# Altium schematic sheet Core.SchDoc
size A4; Author: vseasky; Address1: https://docs.liuwei.vin; Revision: V0.2; SheetNumber: 3; SheetTotal: 4
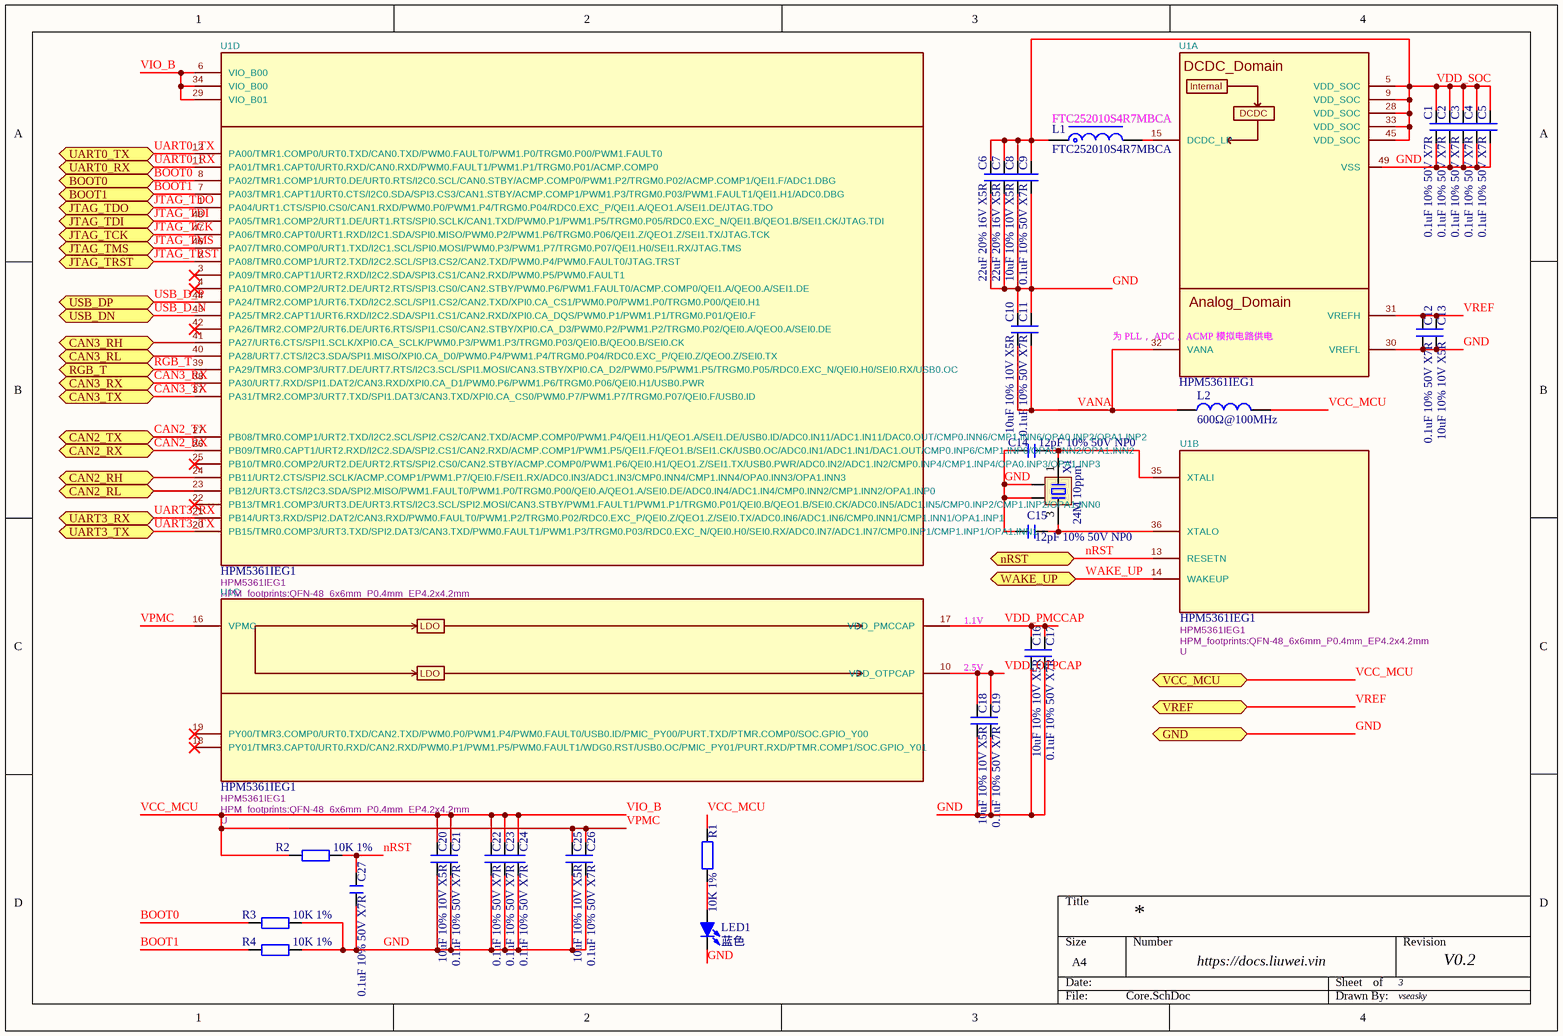
[diagram p0: Core.SchDoc]

## Parts
C1  0.1uF 10% 50V X7R  [C 0603_L]
C2  0.1uF 10% 50V X7R  [C 0603_L]
C3  0.1uF 10% 50V X7R  [C 0603_L]
C4  0.1uF 10% 50V X7R  [C 0603_L]
C5  0.1uF 10% 50V X7R  [C 0603_L]
C6  22uF 20% 16V X5R  [C 0603_L]
C7  22uF 20% 16V X5R  [C 0603_L]
C8  10uF 10% 10V X5R  [C 0603_L]
C9  0.1uF 10% 50V X7R  [C 0603_L]
C10  10uF 10% 10V X5R  [C 0603_L]
C11  0.1uF 10% 50V X7R  [C 0603_L]
C12  0.1uF 10% 50V X7R  [C 0603_L]
C13  10uF 10% 10V X5R  [C 0603_L]
C14  12pF 10% 50V NP0  [C 0603_L]
C15  12pF 10% 50V NP0  [C 0603_L]
C16  10uF 10% 10V X5R  [C 0603_L]
C17  0.1uF 10% 50V X7R  [C 0603_L]
C18  10uF 10% 10V X5R  [C 0603_L]
C19  0.1uF 10% 50V X7R  [C 0603_L]
C20  10uF 10% 10V X5R  [C 0603_L]
C21  0.1uF 10% 50V X7R  [C 0603_L]
C22  0.1uF 10% 50V X7R  [C 0603_L]
C23  0.1uF 10% 50V X7R  [C 0603_L]
C24  0.1uF 10% 50V X7R  [C 0603_L]
C25  10uF 10% 10V X5R  [C 0603_L]
C26  0.1uF 10% 50V X7R  [C 0603_L]
C27  0.1uF 10% 50V X7R  [C 0603_L]
L1  FTC252010S4R7MBCA  [NR2520]
L2  600Ω@100MHz  [L 0603_L]
LED1  蓝色  [LED 0603R]
R1  10K 1%  [R 0603_L]
R2  10K 1%  [R 0603_L]
R3  10K 1%  [R 0603_L]
R4  10K 1%  [R 0603_L]
U1  HPM5361IEG1  [QFN-48_6x6mm_P0.4mm_EP4.2x4.2mm]  (parts A,B,C,D of 4)
X1  24M 10ppm  [OSC 3225-4P]

## Ports
BOOT0 (bidir, see VCAN[5C]), BOOT1 (bidir, see VCAN[5C]), CAN2_RH (bidir, see VCAN[4D]), CAN2_RL (bidir, see VCAN[4D]), CAN2_RX (bidir, see VCAN[4E]), CAN2_TX (bidir, see VCAN[4E]), CAN3_RH (bidir, see VCAN[4C]), CAN3_RL (bidir, see VCAN[4C]), CAN3_RX (bidir, see VCAN[4D]), CAN3_TX (bidir, see VCAN[4D]), GND (bidir, see VCAN[4B]), JTAG_TCK (bidir, see VCAN[5E]), JTAG_TDI (bidir, see VCAN[5D]), JTAG_TDO (bidir, see VCAN[5D]), JTAG_TMS (bidir, see VCAN[5E]), JTAG_TRST (bidir, see VCAN[5D]), nRST (bidir, see VCAN[5D]), RGB_T (bidir, see VCAN[4C]), UART0_RX (bidir, see VCAN[5B]), UART0_TX (bidir, see VCAN[5B]), UART3_RX (bidir, see VCAN[4C]), UART3_TX (bidir, see VCAN[4C]), USB_DN (bidir, see VCAN[5C]), USB_DP (bidir, see VCAN[5D]), VCC_MCU (bidir, see VCAN[5C]), VREF (bidir, see VCAN[5C]), WAKE_UP (bidir, see VCAN[5E])

## Nets
BOOT0: R3.1 U1.8(PA02/TMR1.COMP1/URT0.DE/URT0.RTS/I2C0.SCL/CAN0.STBY/ACMP.COMP0/PWM1.P2/TRGM0.P02/ACMP.COMP1/QEI1.F/ADC1.DBG) ; port BOOT0
BOOT1: R4.1 U1.7(PA03/TMR1.CAPT1/URT0.CTS/I2C0.SDA/SPI3.CS3/CAN1.STBY/ACMP.COMP1/PWM1.P3/TRGM0.P03/PWM1.FAULT1/QEI1.H1/ADC0.DBG) ; port BOOT1
CAN2_RH: U1.24(PB11/URT2.CTS/SPI2.SCLK/ACMP.COMP1/PWM1.P7/QEI0.F/SEI1.RX/ADC0.IN3/ADC1.IN3/CMP0.INN4/CMP1.INN4/OPA0.INN3/OPA1.INN3) ; port CAN2_RH
CAN2_RL: U1.23(PB12/URT3.CTS/I2C3.SDA/SPI2.MISO/PWM1.FAULT0/PWM1.P0/TRGM0.P00/QEI0.A/QEO1.A/SEI0.DE/ADC0.IN4/ADC1.IN4/CMP0.INN2/CMP1.INN2/OPA1.INP0) ; port CAN2_RL
CAN2_RX: U1.26(PB09/TMR0.CAPT1/URT2.RXD/I2C2.SDA/SPI2.CS1/CAN2.RXD/ACMP.COMP1/PWM1.P5/QEI1.F/QEO1.B/SEI1.CK/USB0.OC/ADC0.IN1/ADC1.IN1/DAC1.OUT/CMP0.INP6/CMP1.INP6/OPA0.INN2/OPA1.INN2) ; port CAN2_RX
CAN2_TX: U1.27(PB08/TMR0.COMP1/URT2.TXD/I2C2.SCL/SPI2.CS2/CAN2.TXD/ACMP.COMP0/PWM1.P4/QEI1.H1/QEO1.A/SEI1.DE/USB0.ID/ADC0.IN11/ADC1.IN11/DAC0.OUT/CMP0.INN6/CMP1.INN6/OPA0.INP2/OPA1.INP2) ; port CAN2_TX
CAN3_RH: U1.41(PA27/URT6.CTS/SPI1.SCLK/XPI0.CA_SCLK/PWM0.P3/PWM1.P3/TRGM0.P03/QEI0.B/QEO0.B/SEI0.CK) ; port CAN3_RH
CAN3_RL: U1.40(PA28/URT7.CTS/I2C3.SDA/SPI1.MISO/XPI0.CA_D0/PWM0.P4/PWM1.P4/TRGM0.P04/RDC0.EXC_P/QEI0.Z/QEO0.Z/SEI0.TX) ; port CAN3_RL
CAN3_RX: U1.38(PA30/URT7.RXD/SPI1.DAT2/CAN3.RXD/XPI0.CA_D1/PWM0.P6/PWM1.P6/TRGM0.P06/QEI0.H1/USB0.PWR) ; port CAN3_RX
CAN3_TX: U1.37(PA31/TMR2.COMP3/URT7.TXD/SPI1.DAT3/CAN3.TXD/XPI0.CA_CS0/PWM0.P7/PWM1.P7/TRGM0.P07/QEI0.F/USB0.ID) ; port CAN3_TX
GND: C1.1 C2.1 C3.1 C4.1 C5.1 C6.1 C7.1 C8.1 C9.1 C10.2 C11.2 C12.1 C13.1 C14.2 C15.2 C16.1 C17.1 C18.1 C19.1 C20.1 C21.1 C22.1 C23.1 C24.2 C25.1 C26.1 C27.1 LED1.2(K) R3.2 R4.2 U1.30(VREFL) U1.49(VSS) X1.2 X1.4 ; port GND
JTAG_TCK: U1.47(PA06/TMR0.CAPT0/URT1.RXD/I2C1.SDA/SPI0.MISO/PWM0.P2/PWM1.P6/TRGM0.P06/QEI1.Z/QEO1.Z/SEI1.TX/JTAG.TCK) ; port JTAG_TCK
JTAG_TDI: U1.48(PA05/TMR1.COMP2/URT1.DE/URT1.RTS/SPI0.SCLK/CAN1.TXD/PWM0.P1/PWM1.P5/TRGM0.P05/RDC0.EXC_N/QEI1.B/QEO1.B/SEI1.CK/JTAG.TDI) ; port JTAG_TDI
JTAG_TDO: U1.1(PA04/URT1.CTS/SPI0.CS0/CAN1.RXD/PWM0.P0/PWM1.P4/TRGM0.P04/RDC0.EXC_P/QEI1.A/QEO1.A/SEI1.DE/JTAG.TDO) ; port JTAG_TDO
JTAG_TMS: U1.46(PA07/TMR0.COMP0/URT1.TXD/I2C1.SCL/SPI0.MOSI/PWM0.P3/PWM1.P7/TRGM0.P07/QEI1.H0/SEI1.RX/JTAG.TMS) ; port JTAG_TMS
JTAG_TRST: U1.2(PA08/TMR0.COMP1/URT2.TXD/I2C2.SCL/SPI3.CS2/CAN2.TXD/PWM0.P4/PWM0.FAULT0/JTAG.TRST) ; port JTAG_TRST
nRST: C27.2 R2.2 U1.13(RESETN) ; port nRST
RGB_T: U1.39(PA29/TMR3.COMP3/URT7.DE/URT7.RTS/I2C3.SCL/SPI1.MOSI/CAN3.STBY/XPI0.CA_D2/PWM0.P5/PWM1.P5/TRGM0.P05/RDC0.EXC_N/QEI0.H0/SEI0.RX/USB0.OC) ; port RGB_T
UART0_RX: U1.11(PA01/TMR1.CAPT0/URT0.RXD/CAN0.RXD/PWM0.FAULT1/PWM1.P1/TRGM0.P01/ACMP.COMP0) ; port UART0_RX
UART0_TX: U1.12(PA00/TMR1.COMP0/URT0.TXD/CAN0.TXD/PWM0.FAULT0/PWM1.P0/TRGM0.P00/PWM1.FAULT0) ; port UART0_TX
UART3_RX: U1.21(PB14/URT3.RXD/SPI2.DAT2/CAN3.RXD/PWM0.FAULT0/PWM1.P2/TRGM0.P02/RDC0.EXC_P/QEI0.Z/QEO1.Z/SEI0.TX/ADC0.IN6/ADC1.IN6/CMP0.INN1/CMP1.INN1/OPA1.INP1) ; port UART3_RX
UART3_TX: U1.20(PB15/TMR0.COMP3/URT3.TXD/SPI2.DAT3/CAN3.TXD/PWM0.FAULT1/PWM1.P3/TRGM0.P03/RDC0.EXC_N/QEI0.H0/SEI0.RX/ADC0.IN7/ADC1.IN7/CMP0.INP1/CMP1.INP1/OPA1.INN1) ; port UART3_TX
USB_D_N: U1.43(PA25/TMR2.CAPT1/URT6.RXD/I2C2.SDA/SPI1.CS1/CAN2.RXD/XPI0.CA_DQS/PWM0.P1/PWM1.P1/TRGM0.P01/QEI0.F) ; port USB_DN
USB_D_P: U1.44(PA24/TMR2.COMP1/URT6.TXD/I2C2.SCL/SPI1.CS2/CAN2.TXD/XPI0.CA_CS1/PWM0.P0/PWM1.P0/TRGM0.P00/QEI0.H1) ; port USB_DP
VANA: C10.1 C11.1 L2.1 U1.32(VANA)
VCC_MCU: C20.2 C21.2 C22.2 C23.2 C24.1 C25.2 C26.2 L2.2 R1.2 R2.1 U1.6(VIO_B00) U1.16(VPMC) U1.29(VIO_B01) U1.34(VIO_B00) ; port VCC_MCU  [also labelled VIO_B, VPMC]
VDD_OTPCAP: C18.2 C19.2 U1.10(VDD_OTPCAP)
VDD_PMCCAP: C16.2 C17.2 U1.17(VDD_PMCCAP)
VDD_SOC: C1.2 C2.2 C3.2 C4.2 C5.2 C6.2 C7.2 C8.2 C9.2 L1.1 U1.5(VDD_SOC) U1.9(VDD_SOC) U1.28(VDD_SOC) U1.33(VDD_SOC) U1.45(VDD_SOC)
VREF: C12.2 C13.2 U1.31(VREFH) ; port VREF
WAKE_UP: U1.14(WAKEUP) ; port WAKE_UP
NetC14_1: C14.1 U1.35(XTALI) X1.1
NetC15_1: C15.1 U1.36(XTALO) X1.3
NetL1_2: L1.2 U1.15(DCDC_LP)
NetLED1_1: LED1.1(A) R1.1

Not connected (* = marked no-connect by the designer): U1 3(PA09/TMR0.CAPT1/URT2.RXD/I2C2.SDA/SPI3.CS1/CAN2.RXD/PWM0.P5/PWM0.FAULT1)* 4(PA10/TMR0.COMP2/URT2.DE/URT2.RTS/SPI3.CS0/CAN2.STBY/PWM0.P6/PWM1.FAULT0/ACMP.COMP0/QEI1.A/QEO0.A/SEI1.DE)* 18(PY01/TMR3.CAPT0/URT0.RXD/CAN2.RXD/PWM0.P1/PWM1.P5/PWM0.FAULT1/WDG0.RST/USB0.OC/PMIC_PY01/PURT.RXD/PTMR.COMP1/SOC.GPIO_Y01)* 19(PY00/TMR3.COMP0/URT0.TXD/CAN2.TXD/PWM0.P0/PWM1.P4/PWM0.FAULT0/USB0.ID/PMIC_PY00/PURT.TXD/PTMR.COMP0/SOC.GPIO_Y00)* 22(PB13/TMR1.COMP3/URT3.DE/URT3.RTS/I2C3.SCL/SPI2.MOSI/CAN3.STBY/PWM1.FAULT1/PWM1.P1/TRGM0.P01/QEI0.B/QEO1.B/SEI0.CK/ADC0.IN5/ADC1.IN5/CMP0.INP2/CMP1.INP2/OPA1.INN0)* 25(PB10/TMR0.COMP2/URT2.DE/URT2.RTS/SPI2.CS0/CAN2.STBY/ACMP.COMP0/PWM1.P6/QEI0.H1/QEO1.Z/SEI1.TX/USB0.PWR/ADC0.IN2/ADC1.IN2/CMP0.INP4/CMP1.INP4/OPA0.INP3/OPA1.INP3)* 42(PA26/TMR2.COMP2/URT6.DE/URT6.RTS/SPI1.CS0/CAN2.STBY/XPI0.CA_D3/PWM0.P2/PWM1.P2/TRGM0.P02/QEI0.A/QEO0.A/SEI0.DE)*

## Notes on the sheet
- (near L1) FTC252010S4R7MBCA
- (near U1) 为 PLL， ADC， ACMP 模拟电路供电
- 1.1V
- 2.5V
- (in symbol HPM5361IEG1, part A) DCDC_Domain; Internal; DCDC; Analog_Domain
- (in symbol HPM5361IEG1, part C) LDO

## Library data of the parts
C1-C27 = C: 贴片电容
L1 = L-NR: NR磁胶电感
L2 = L: 小功率贴片电感
LED1 = LED-SMD: 贴片LED
R1-R4 = R: 贴片电阻
U1 = HPM5361IEG1: Reference: U; Value: HPM5361IEG1; Footprint: HPM_footprints:QFN-48_6x6mm_P0.4mm_EP4.2x4.2mm
X1 = XTAL-4P: 4脚无源晶振